# Altium project OK6410.PRJPCB (part 2 of 2)

## Sheet LED_USB_KEY.SchDoc
size 558 x 431 mm
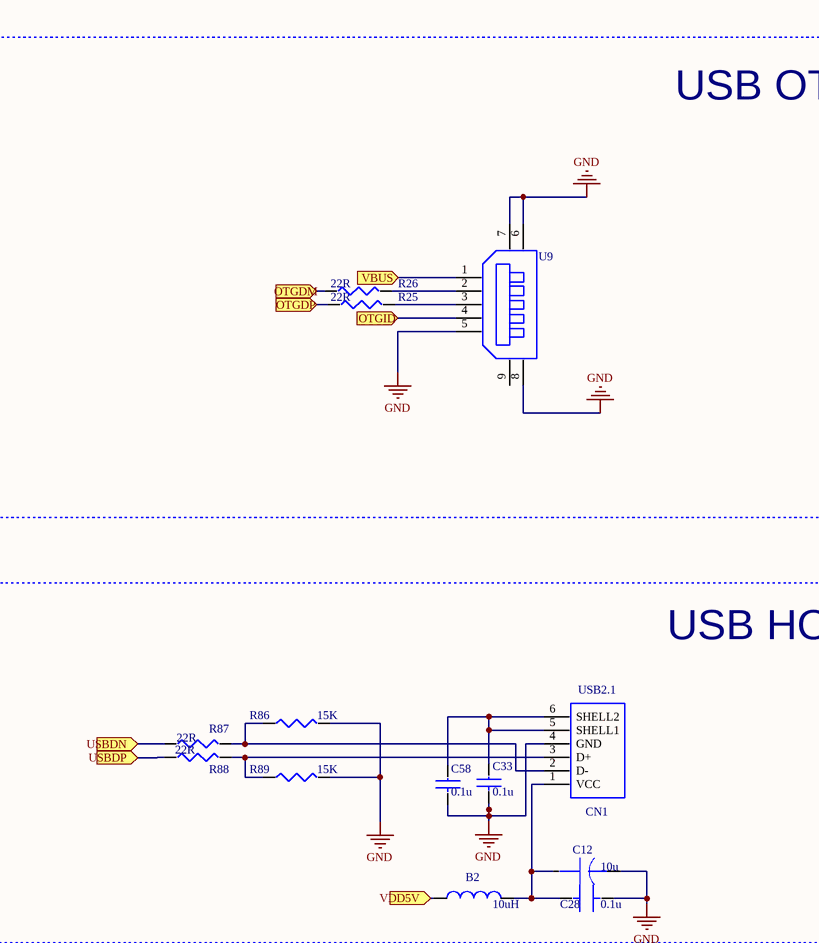
[diagram p20: LED_USB_KEY.SchDoc, top left]
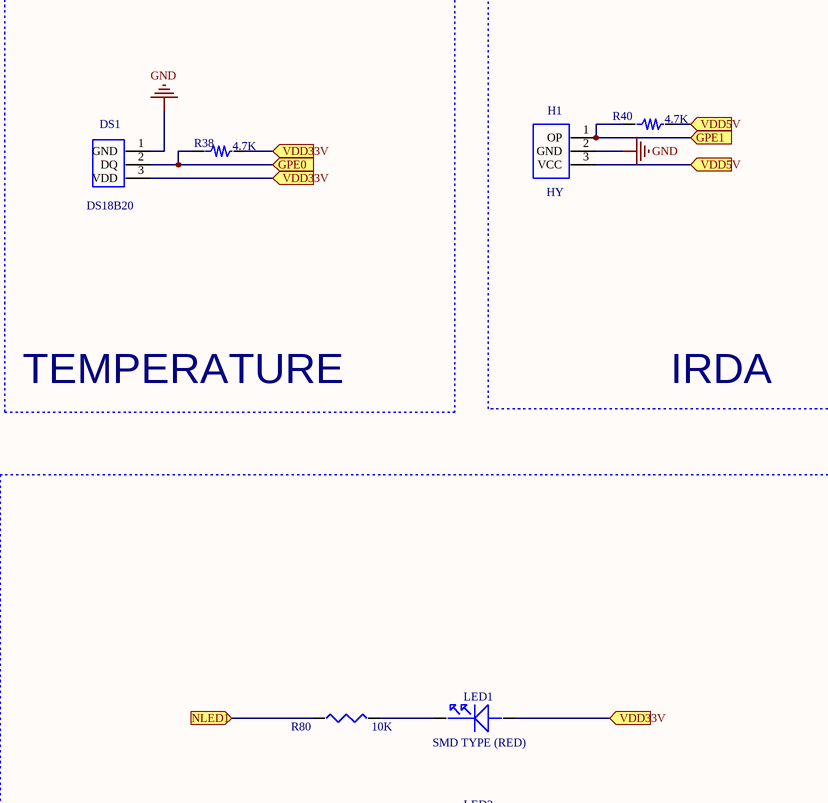
[diagram p21: LED_USB_KEY.SchDoc, top right]
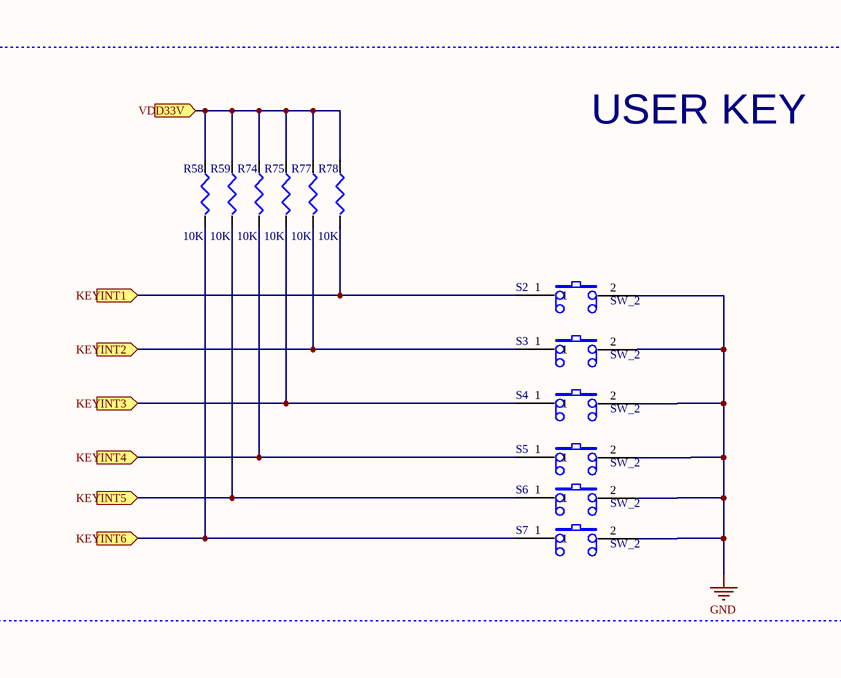
[diagram p22: LED_USB_KEY.SchDoc, bottom left]
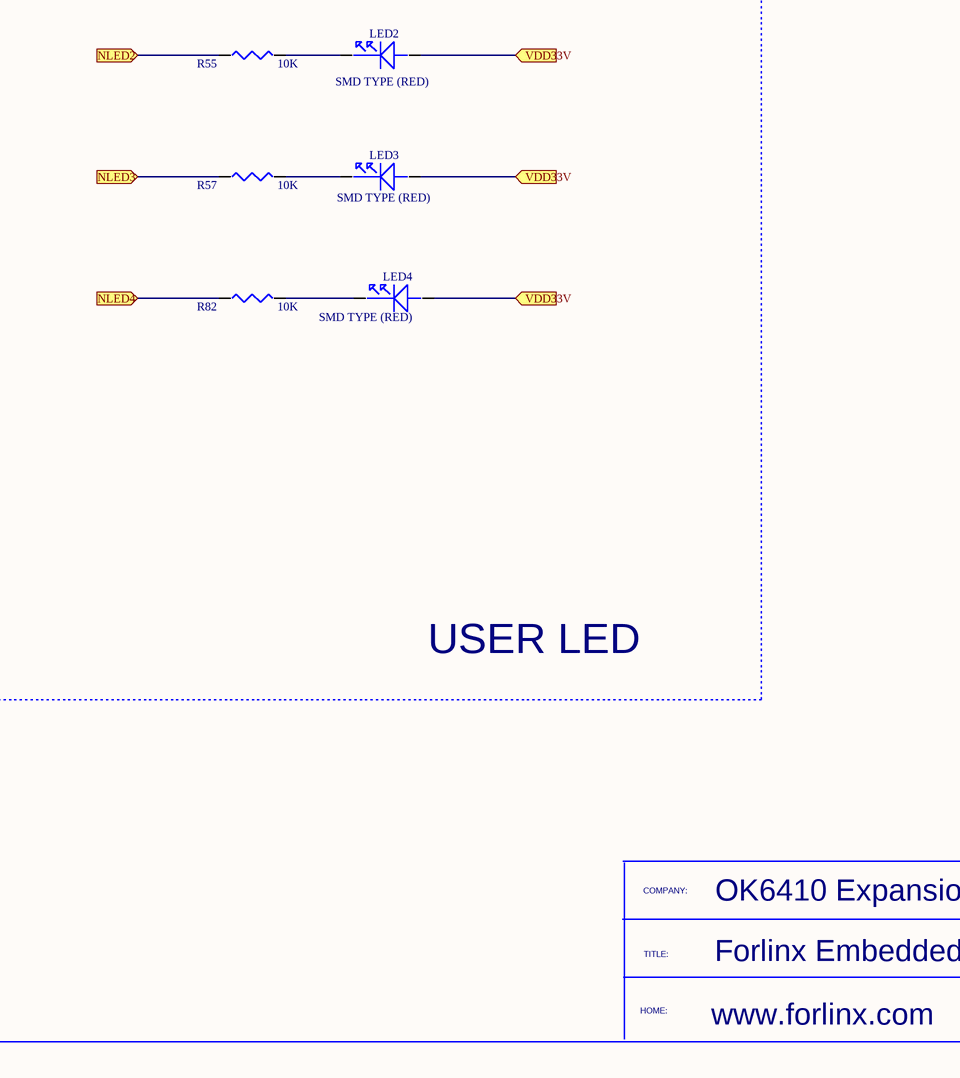
[diagram p23: LED_USB_KEY.SchDoc, bottom right]

### Parts
B2  value 10uH  (hidden comment: INDUCTOR_0)
C12  value 10u  (hidden comment: CAP-AE4)
C28  value 0.1u  (hidden comment: CAP_0)
C33  value 0.1u  (hidden comment: CAP_NP_0)
C58  value 0.1u  (hidden comment: CAP_NP_0)
CN1  USB2.1
DS1  DS18B20
H1  HY
LED1  value SMD TYPE (RED)  (hidden comment: LED_0)
LED2  value SMD TYPE (RED)  (hidden comment: LED_0)
LED3  value SMD TYPE (RED)  (hidden comment: LED_0)
LED4  value SMD TYPE (RED)  (hidden comment: LED_0)
R25  value 22R  (hidden comment: RESISTOR_2)
R26  value 22R  (hidden comment: RESISTOR_2)
R38  value 4.7K  (hidden comment: RES-Z)
R40  value 4.7K  (hidden comment: RES-Z)
R55  value 10K  (hidden comment: RESISTOR_2)
R57  value 10K  (hidden comment: RESISTOR_2)
R58  value 10K  (hidden comment: RESISTOR_2)
R59  value 10K  (hidden comment: RESISTOR_2)
R74  value 10K  (hidden comment: RESISTOR_2)
R75  value 10K  (hidden comment: RESISTOR_2)
R77  value 10K  (hidden comment: RESISTOR_2)
R78  value 10K  (hidden comment: RESISTOR_2)
R80  value 10K  (hidden comment: RESISTOR_2)
R82  value 10K  (hidden comment: RESISTOR_2)
R86  value 15K  (hidden comment: RESISTOR_2)
R87  value 22R  (hidden comment: RESISTOR_2)
R88  value 22R  (hidden comment: RESISTOR_2)
R89  value 15K  (hidden comment: RESISTOR_2)
S2  SW_2
S3  SW_2
S4  SW_2
S5  SW_2
S6  SW_2
S7  SW_2
U9  56579-0576  (value not drawn)

### Blocks framed on the sheet
USB OTG: R25 R26 U9
TEMPERATURE: DS1 R38
IRDA: H1 R40
USER LED: LED1-LED4 R55 R57 R80 R82
USB HOST: B2 C12 C28 C33 C58 CN1 R86-R89
USER KEY: R58 R59 R74 R75 R77 R78 S2-S7

### Ports
GPE0, GPE1, KEYINT1, KEYINT2, KEYINT3, KEYINT4, KEYINT5, KEYINT6, NLED1, NLED2, NLED3, NLED4, OTGDM, OTGDP, OTGID, USBDN, USBDP, VBUS, VDD5V, VDD33V

### Nets
GND: C12.2 C28.2 C33.2 C58.2 CN1.4(GND) DS1.1(GND) H1.2(GND) R86.2 R89.2 S2.2 S3.2 S4.2 S5.2 S6.2 S7.2 U9.1 U9.5 U9.6 U9.7 U9.8 ; port VBUS
NetB1_1: DS1.3(VDD) LED1.1 LED2.1 LED3.1 LED4.1 R38.2 R58.1 R59.1 R74.1 R75.1 R77.1 R78.1 ; port VDD33V
NetB2_1: B2.1 H1.3(VCC) R40.2 ; port VDD5V
NetB2_2: B2.2 C12.1 C28.1 CN1.1(VCC)
NetC33_1: C33.1 C58.1 CN1.2(D-) CN1.5(SHELL1) CN1.6(SHELL2) R86.1 R87.2
NetCN1_3: CN1.3(D+) R88.2 R89.1
NetDS1_2: DS1.2(DQ) R38.1 ; port GPE0
NetH1_1: H1.1(OP) R40.1 ; port GPE1
NetJ2_16: R88.1 ; port USBDP
NetJ2_18: R87.1 ; port USBDN
NetJ2_39: R82.1 ; port NLED4
NetJ2_46: R57.1 ; port NLED3
NetJ2_47: R80.1 ; port NLED1
NetJ2_49: R55.1 ; port NLED2
NetJ2_61: R58.2 S7.1 ; port KEYINT6
NetJ2_63: R74.2 S5.1 ; port KEYINT4
NetJ3_19: R75.2 S4.1 ; port KEYINT3
NetJ3_20: R59.2 S6.1 ; port KEYINT5
NetJ3_22: R78.2 S2.1 ; port KEYINT1
NetJ3_36: U9.4 ; port OTGID
NetJ3_38: R25.1 ; port OTGDP
NetJ3_40: R26.1 ; port OTGDM
NetJ3_49: R77.2 S3.1 ; port KEYINT2
NetLED1_2: LED1.2 R80.2
NetLED2_2: LED2.2 R55.2
NetLED3_2: LED3.2 R57.2
NetLED4_2: LED4.2 R82.2
NetR25_2: R25.2 U9.3
NetR26_2: R26.2 U9.2

Not connected (* = marked no-connect by the designer): U9 9

### Notes on the sheet
- COMPANY:
- TITLE:
- OK6410 Expansion Board
- HOME:
- www.forlinx.com
- Forlinx Embedded

### Library data of the parts
B2 = INDUCTOR_0: PCB DECAL: 1206
C12 = CAP-AE4: ALUMINUM ELECTROLYTIC CAP.; Manufacturer #1: IPC SM-782 STD.; PCB DECAL: 3216A
C28 = CAP_0: PCB Footprint: C0805; Source Path: C:\ORCADWIN\CAPTURE\DESIGN\MCU\S3C2400X\EV-BOARD\SMDK2400-72F.DSN; PCB DECAL: 0603A
C33 C58 = CAP_NP_0: PCB Footprint: C2012; PCB DECAL: 0603A
CN1 = USB2.1: PCB DECAL: USB-B2
DS1 = DS18B20: PCB DECAL: DSAAAA
H1 = HY: PCB DECAL: HY01
LED1-LED3 = LED_0: PCB Footprint: CAP3528; PCB DECAL: LEDX
LED4 = LED_0: PCB Footprint: CAP3528; PCB DECAL: LED1206N
R25 R26 R86-R89 = RESISTOR_2: PCB Footprint: C2012; PCB DECAL: 0603A
R38 R40 = RES-Z: RES BODY:060 CENTERS:400; PCB DECAL: 0603A
R55 R57-R59 R74 R75 R77 R78 R80 R82 = RESISTOR_2: PCB Footprint: C2012; Source Path: C:\WINDOW\GENERAL\2400\SCHEM\2400\SMDK2400-72F.DSN; PCB DECAL: 0603A
S2-S7 = SW_2: PCB Footprint: TM118D-A; Value: SW_PUSH2; PCB DECAL: SW-PB2
U9 = 56579-0576: PCB DECAL: USB\S

## Sheet NET.SchDoc
size 558 x 431 mm
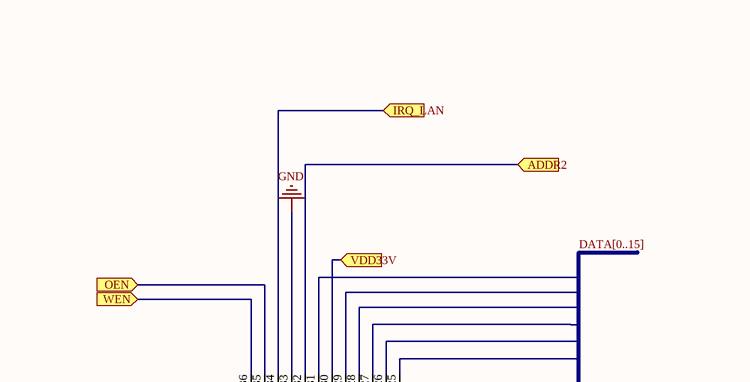
[diagram p24: NET.SchDoc, top left]
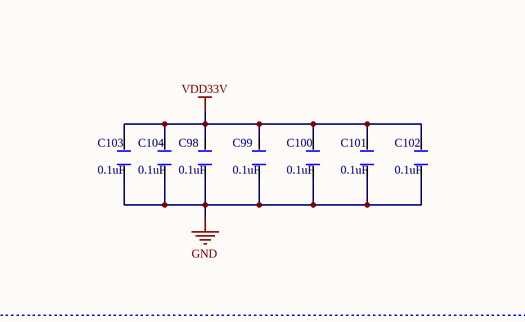
[diagram p25: NET.SchDoc, top right]
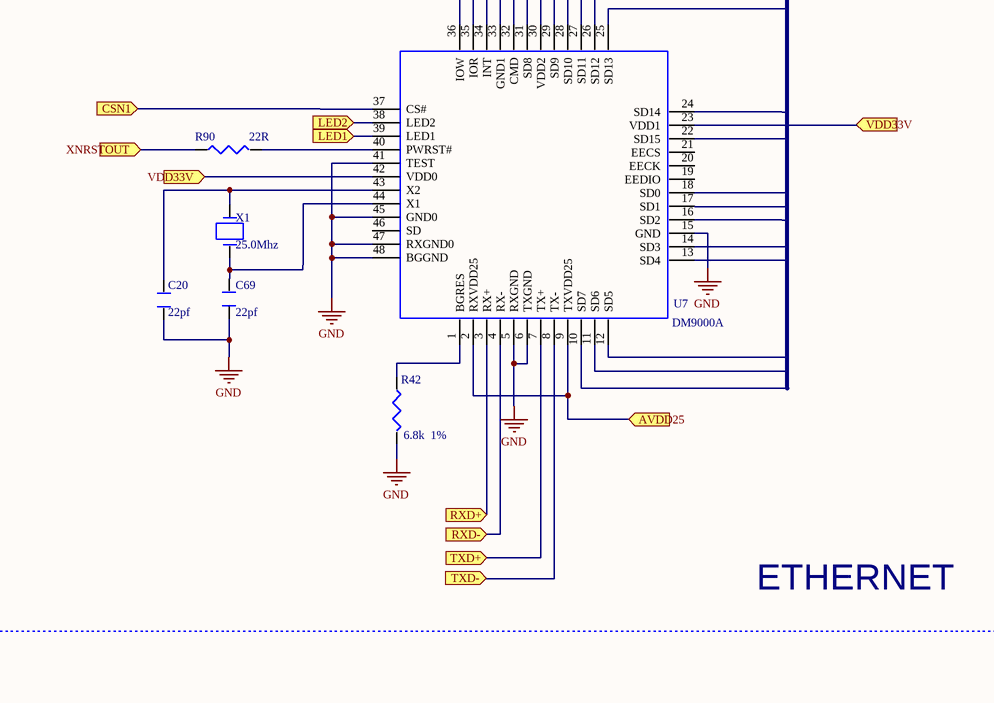
[diagram p26: NET.SchDoc, bottom left]
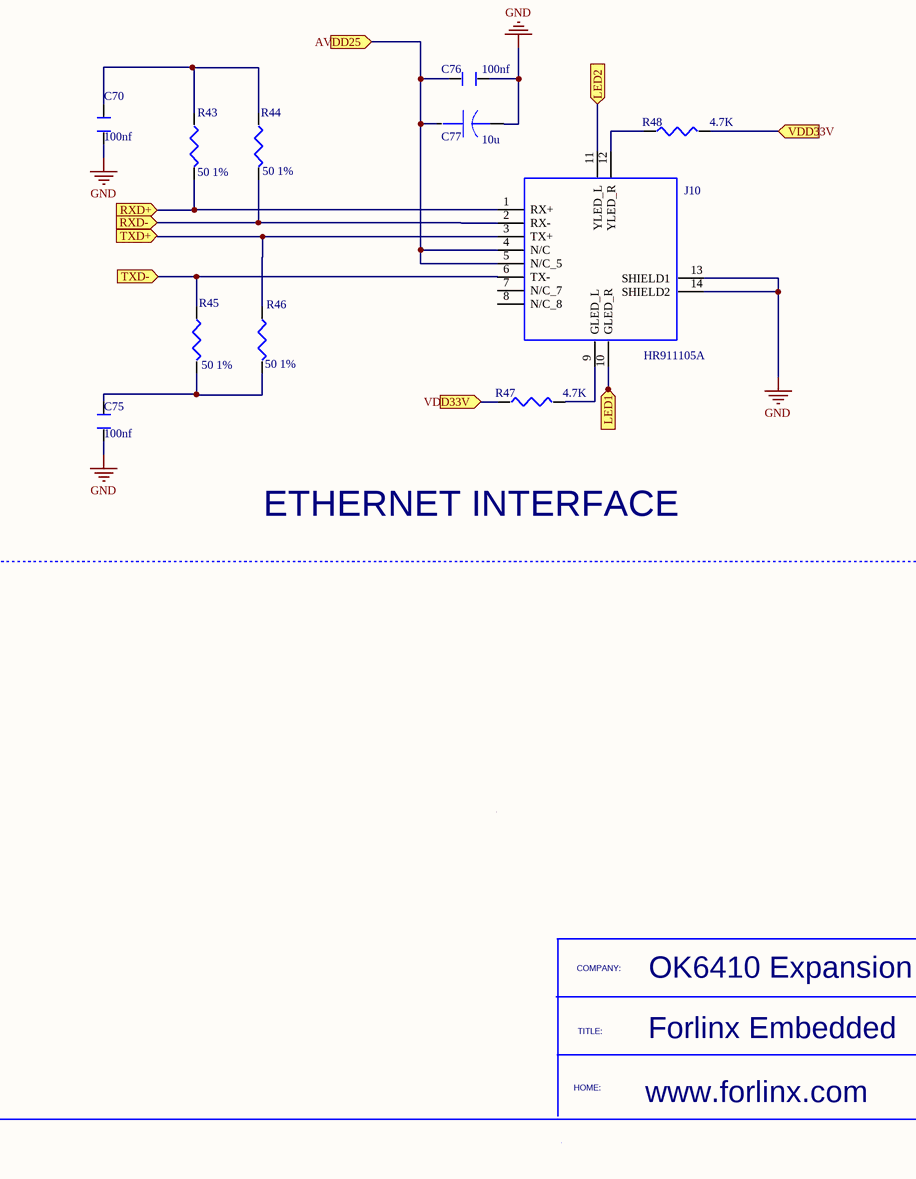
[diagram p27: NET.SchDoc, bottom right]

### Parts
C20  value 22pf  (hidden comment: C_0)
C69  value 22pf  (hidden comment: C_0)
C70  value 100nf  (hidden comment: C_0)
C75  value 100nf  (hidden comment: C_0)
C76  value 100nf  (hidden comment: C_0)
C77  value 10u  (hidden comment: CAP-AE4)
C98  value 0.1uF  (hidden comment: C_0)
C99  value 0.1uF  (hidden comment: C_0)
C100  value 0.1uF  (hidden comment: C_0)
C101  value 0.1uF  (hidden comment: C_0)
C102  value 0.1uF  (hidden comment: C_0)
C103  value 0.1uF  (hidden comment: C_0)
C104  value 0.1uF  (hidden comment: C_0)
J10  HR911105A
R42  value 6.8k  1%  (hidden comment: R_0)
R43  value 50 1%  (hidden comment: R_0)
R44  value 50 1%  (hidden comment: R_0)
R45  value 50 1%  (hidden comment: R_0)
R46  value 50 1%  (hidden comment: R_0)
R47  value 4.7K  (hidden comment: R_0)
R48  value 4.7K  (hidden comment: R_0)
R90  value 22R  (hidden comment: R_0)
U7  DM9000A
X1  value 25.0Mhz  (hidden comment: CRYSTALA)

### Blocks framed on the sheet
ETHERNET: C20 C69 R42 R90 U7 X1
ETHERNET INTERFACE: C70 C75-C77 J10 R43-R48

### Ports
ADDR2, AVDD25, CSN1, IRQ_LAN, LED1, LED2, OEN, RXD+, RXD-, TXD+, TXD-, VDD33V, WEN, XNRSTOUT

### Nets
GND: C20.1 C69.1 C70.1 C75.1 C76.1 C77.2 C98.1 C99.1 C100.1 C101.1 C102.1 C103.1 C104.1 J10.13(SHIELD1) J10.14(SHIELD2) R42.2 U7.5(RXGND) U7.6(TXGND) U7.15(GND) U7.33(GND1) U7.41(TEST) U7.45(GND0) U7.47(RXGND0) U7.48(BGGND)
VDD33V: C98.2 C99.2 C100.2 C101.2 C102.2 C103.2 C104.2
NetB1_1: R47.1 R48.2 U7.23(VDD1) U7.30(VDD2) U7.42(VDD0) ; port VDD33V
NetC20_2: C20.2 U7.43(X2) X1.2
NetC69_2: C69.2 U7.44(X1) X1.1
NetC70_2: C70.2 R43.1 R44.1
NetC75_2: C75.2 R45.2 R46.2
NetC76_2: C76.2 C77.1 J10.4(N/C) J10.5(N/C_5) U7.2(RXVDD25) U7.9(TXVDD25) ; port AVDD25
NetJ1_9: U7.32(CMD) ; port ADDR2
NetJ1_12: U7.36(IOW) ; port WEN
NetJ2_57: U7.34(INT) ; port IRQ_LAN
NetJ2_71: R90.1 ; port XNRSTOUT
NetJ3_69: U7.37(CS#) ; port CSN1
NetJ4_33: U7.35(IOR) ; port OEN
NetJ10_1: J10.1(RX+) R43.2 U7.3(RX+) ; port RXD+
NetJ10_2: J10.2(RX-) R44.2 U7.4(RX-) ; port RXD-
NetJ10_3: J10.3(TX+) R46.1 U7.7(TX+) ; port TXD+
NetJ10_6: J10.6(TX-) R45.1 U7.8(TX-) ; port TXD-
NetJ10_9: J10.9(GLED_L) R47.2
NetJ10_10: J10.10(GLED_R) U7.39(LED1) ; port LED1
NetJ10_11: J10.11(YLED_L) U7.38(LED2) ; port LED2
NetJ10_12: J10.12(YLED_R) R48.1
NetR42_1: R42.1 U7.1(BGRES)
NetR90_2: R90.2 U7.40(PWRST#)

Not connected (* = marked no-connect by the designer): J10 7(N/C_7) 8(N/C_8); U7 10(SD7) 11(SD6) 12(SD5) 13(SD4) 14(SD3) 16(SD2) 17(SD1) 18(SD0) 19(EEDIO) 20(EECK) 21(EECS) 22(SD15) 24(SD14) 25(SD13) 26(SD12) 27(SD11) 28(SD10) 29(SD9) 31(SD8) 46(SD)

### Buses and harness runs
bus DATA[0..15]

### Notes on the sheet
- COMPANY:
- TITLE:
- OK6410 Expansion Board
- HOME:
- Forlinx Embedded
- www.forlinx.com

### Library data of the parts
C20 C69 C70 C75 C76 C98-C104 = C_0: PCB Footprint: CM75; PCB DECAL: 0603A
C77 = CAP-AE4: as C12 on sheet LED_USB_KEY
J10 = HR911105A: PCB DECAL: RJ-45A12
R42-R48 R90 = R_0: PCB Footprint: C2012; PCB DECAL: 0603A
U7 = DM9000A: PCB DECAL: DM9000AE
X1 = CRYSTALA: PCB Footprint: X-C; PCB DECAL: OSC2PR-1

## Sheet POWER.SchDoc
size 558 x 431 mm
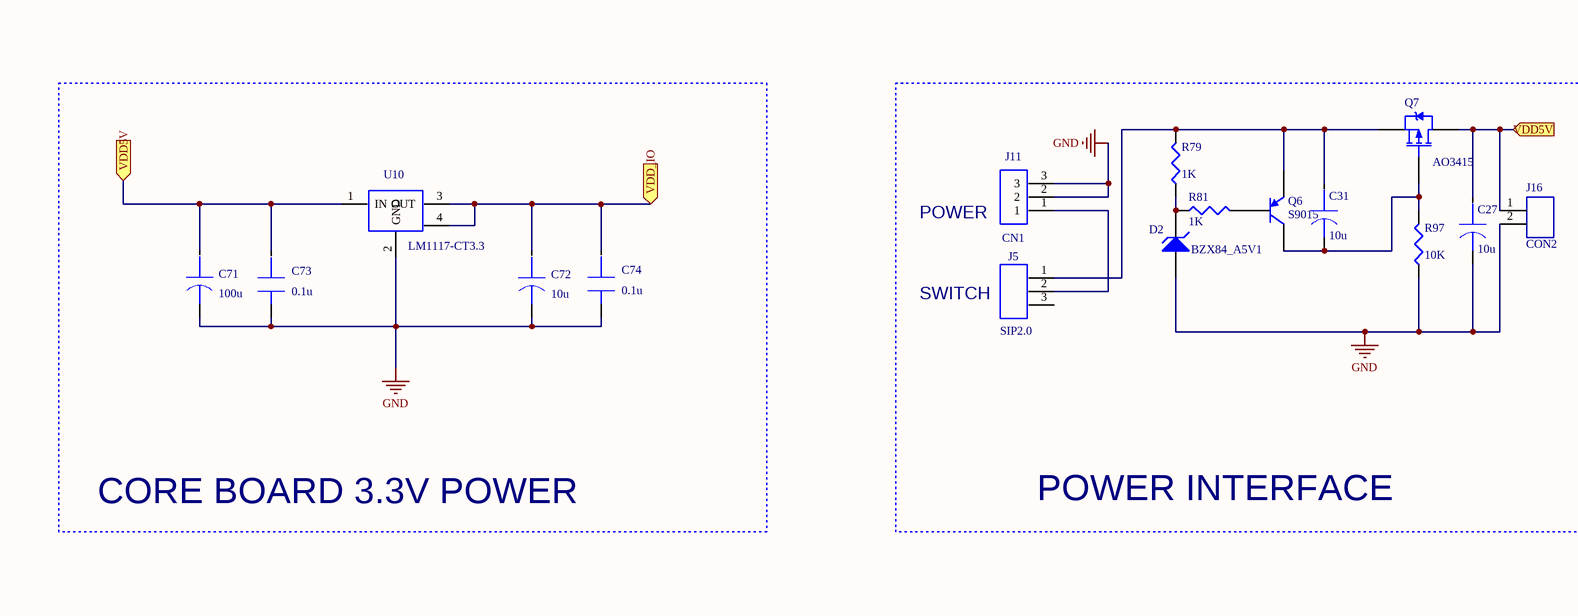
[diagram p28: POWER.SchDoc, top left]
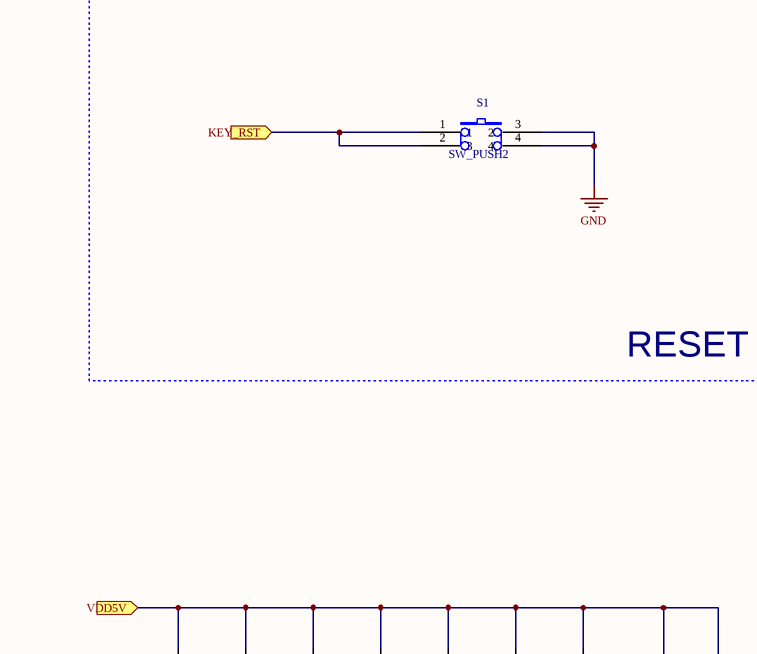
[diagram p29: POWER.SchDoc, top right]
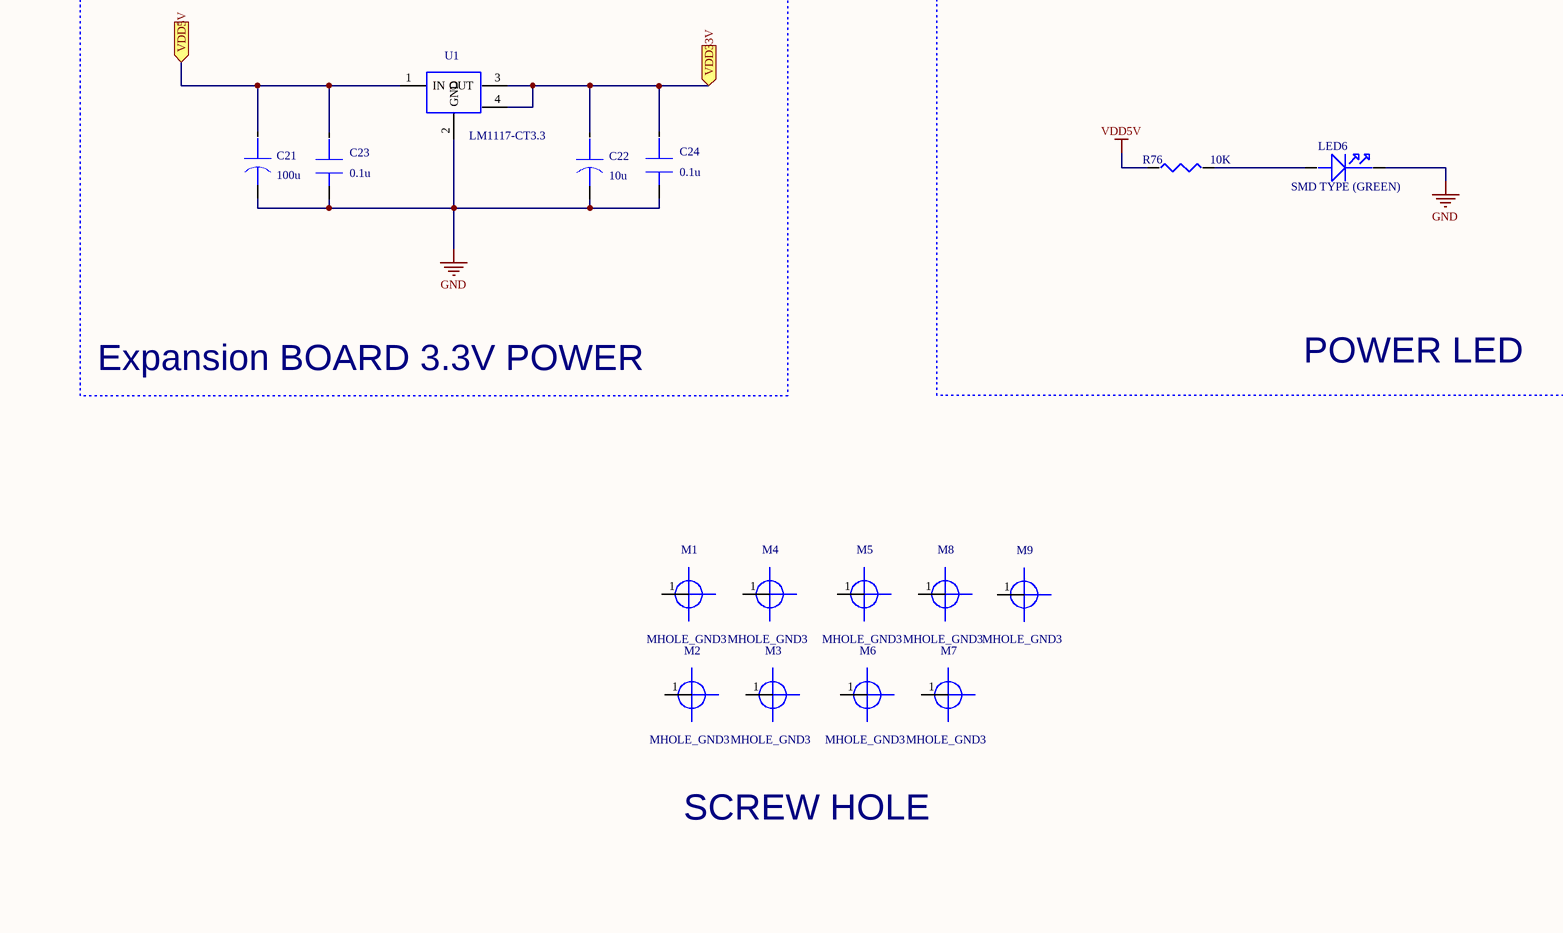
[diagram p30: POWER.SchDoc, bottom left]
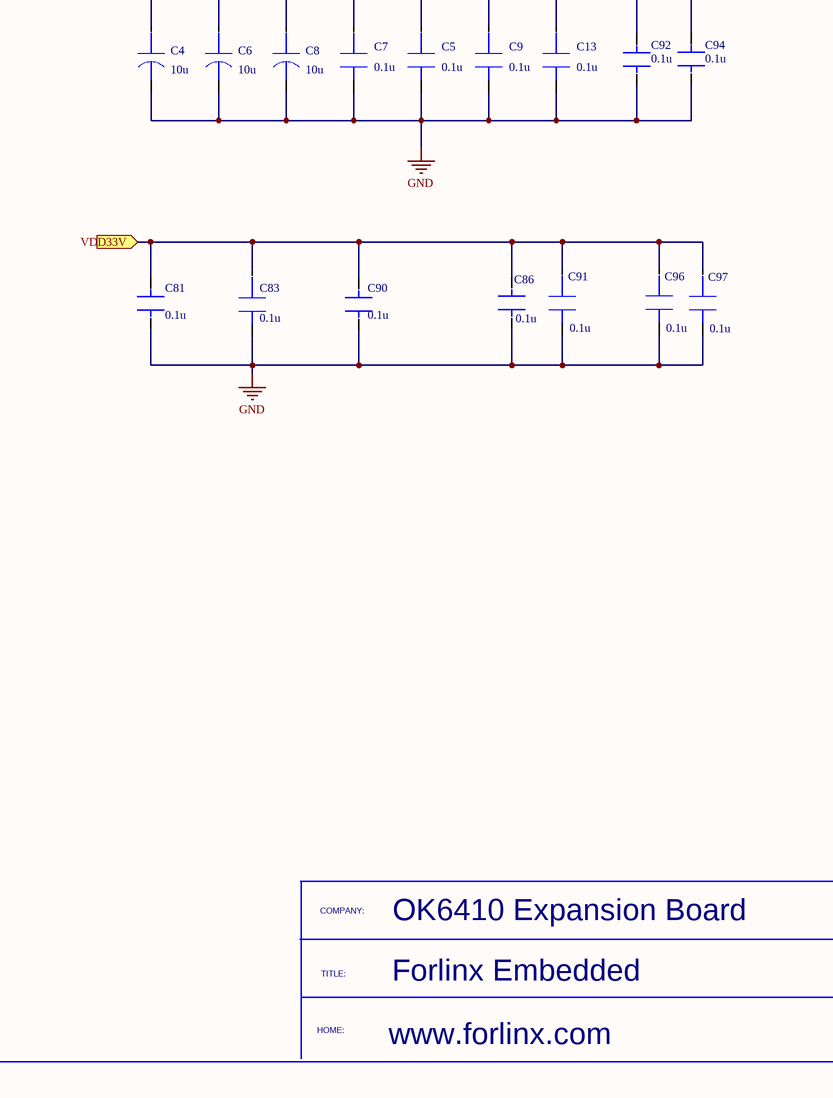
[diagram p31: POWER.SchDoc, bottom right]

### Parts
C4  value 10u  (hidden comment: CAP-AE4)
C5  value 0.1u  (hidden comment: CAP1206)
C6  value 10u  (hidden comment: CAP-AE4)
C7  value 0.1u  (hidden comment: CAP1206)
C8  value 10u  (hidden comment: CAP-AE4)
C9  value 0.1u  (hidden comment: CAP1206)
C13  value 0.1u  (hidden comment: CAP1206)
C21  value 100u  (hidden comment: CAP-AE4)
C22  value 10u  (hidden comment: CAP-AE4)
C23  value 0.1u  (hidden comment: CAP1206)
C24  value 0.1u  (hidden comment: CAP1206)
C27  value 10u  (hidden comment: CAP-AE4)
C31  value 10u  (hidden comment: CAP-AE4)
C71  value 100u  (hidden comment: CAP-AE4)
C72  value 10u  (hidden comment: CAP-AE4)
C73  value 0.1u  (hidden comment: CAP1206)
C74  value 0.1u  (hidden comment: CAP1206)
C81  value 0.1u  (hidden comment: CAP_0)
C83  value 0.1u  (hidden comment: CAP1206)
C86  value 0.1u  (hidden comment: CAP_0)
C90  value 0.1u  (hidden comment: CAP_0)
C91  value 0.1u  (hidden comment: CAP1206)
C92  value 0.1u  (hidden comment: CAP_0)
C94  value 0.1u  (hidden comment: CAP_0)
C96  value 0.1u  (hidden comment: CAP1206)
C97  value 0.1u  (hidden comment: CAP1206)
D2  BZX84_A5V1  [DIODE-0.7]
J5  SIP2.0
J11  CN1
J16  CON2  [SIP2S_2mm]
LED6  value SMD TYPE (GREEN)  (hidden comment: LED_0)
M1  MHOLE_GND3
M2  MHOLE_GND3
M3  MHOLE_GND3
M4  MHOLE_GND3
M5  MHOLE_GND3
M6  MHOLE_GND3
M7  MHOLE_GND3
M8  MHOLE_GND3
M9  MHOLE_GND3
Q6  S9015  [TO-92A]
Q7  AO3415  [TO-220AB]
R76  value 10K  (hidden comment: RESISTOR_2)
R79  value 1K  [J1-0603]  (hidden comment: Res3)
R81  value 1K  [J1-0603]  (hidden comment: Res3)
R97  value 10K  [J1-0603]  (hidden comment: Res3)
S1  SW_PUSH2
U1  LM1117-CT3.3
U10  LM1117-CT3.3

### Blocks framed on the sheet
CORE BOARD 3.3V POWER: C71-C74 U10
POWER INTERFACE: C27 C31 D2 J5 J11 J16 Q6 Q7 R79 R81 R97
RESET: S1
Expansion BOARD 3.3V POWER: C21-C24 U1
POWER LED: LED6 R76

### Ports
KEY_RST, VDD5V, VDD33V, VDD_IO

### Nets
GND: C4.2 C5.2 C6.2 C7.2 C8.2 C9.2 C13.2 C21.2 C22.2 C23.2 C24.2 C27.2 C71.2 C72.2 C73.2 C74.2 C81.2 C83.2 C86.2 C90.2 C91.2 C92.2 C94.2 C96.2 C97.2 D2.1(A) J11.2 J11.3 J16.2(DQ20) LED6.2 R97.1 S1.3(2) S1.4 U1.2(GND) U10.2(GND)
VDD5V: R76.1
NetB1_1: C22.1 C24.1 C81.1 C83.1 C86.1 C90.1 C91.1 C96.1 C97.1 U1.3(OUT) U1.4 ; port VDD33V
NetB2_1: C4.1 C5.1 C6.1 C7.1 C8.1 C9.1 C13.1 C21.1 C23.1 C27.1 C71.1 C73.1 C92.1 C94.1 J16.1(DQ19) Q7.2(D) U1.1(IN) U10.1(IN) ; port VDD5V
NetC31_1: C31.1 J5.1 Q6.1(E) Q7.3(S) R79.2
NetC31_2: C31.2 Q6.3(C) Q7.1(G) R97.2
NetC72_1: C72.1 C74.1 U10.3(OUT) U10.4 ; port VDD_IO
NetD2_2: D2.2(K) R79.1 R81.1
NetJ3_67: S1.1 S1.2(3) ; port KEY_RST
NetJ5_2: J5.2 J11.1
NetLED6_1: LED6.1 R76.2
NetQ6_2: Q6.2(B) R81.2

Not connected (* = marked no-connect by the designer): J5 3; M1 1; M2 1; M3 1; M4 1; M5 1; M6 1; M7 1; M8 1; M9 1

### Notes on the sheet
- POWER
- SWITCH
- SCREW HOLE
- COMPANY:
- OK6410 Expansion Board
- TITLE:
- Forlinx Embedded
- HOME:
- www.forlinx.com

### Library data of the parts
C4 C6 C8 C21 C22 C27 C31 C71 C72 = CAP-AE4: as C12 on sheet LED_USB_KEY
C5 C7 C9 C13 C23 C24 C73 C74 C83 C91 C96 C97 = CAP1206: SURFACE MOUNT CAPACITOR 0.062 X 0.126 INCHES; Manufacturer #1: IPC SM-782 STD.; PCB DECAL: 0603A
C81 C86 C90 C92 C94 = CAP_0: as C28 on sheet LED_USB_KEY
D2 = D Zener: Zener Diode; Published: 8-Jun-2000; LatestRevisionDate: 17-Jul-2002; LatestRevisionNote: Re-released for DXP Platform.; PackageReference: DIODE-0.7; Publisher: Altium Limited; PackageDescription: Diode, Thru-Hole; 2 Leads; 0.7 in Pin Spacing
J5 = SIP2.0: PCB DECAL: SWITCH_A
J11 = CN1: PCB DECAL: JACK-2.5MM_B
LED6 = LED_0: as LED4 on sheet LED_USB_KEY
M1-M9 = MHOLE_GND3: PCB DECAL: HOLE157-8STAR
Q6 = 2N3906: PNP General Purpose Amplifier; Published: 8-Jun-2000; LatestRevisionDate: 15-Jan-2003; LatestRevisionNote: PCB Footprint 'BCY-W3/D4.7' replaced; DatasheetVersion: 1997; PackageVersion: Sep-1998; PackageReference: TO-92A; Publisher: Altium Limited; PackageDescription: TO, Flat Index; 3 In-Line, Axial Leads; Body Dia. 4.5mm; Leads 0.51 x 0.48 mm (max); ComponentLink1Description: Manufacturer Link; ComponentLink1URL: http://www.fairchildsemi.com/; ComponentLink2Description: Datasheet; ComponentLink2URL: http://www.fairchildsemi.com/ds/2N%2F2N3906.pdf
Q7 = PMOS-2: P-Channel Power MOSFET; Note: Pin 4 not drawn and electrically connected to Pin 2.; Published: 8-Jun-2000; LatestRevisionDate: 17-Jul-2002; LatestRevisionNote: Re-released for DXP Platform.; DatasheetVersion: PD-9.390D; PackageVersion: Feb-1997; PackageReference: TO-220AB; Publisher: Altium Limited; PackageDescription: TO, Thru-Hole, Vertical, Heatsink Mounted; 3 In-Line Leads; Pitch 2.54 mm; ComponentLink1Description: Manufacturer Link; ComponentLink1URL: http://www.irf.com/
R76 = RESISTOR_2: PCB Footprint: C2012; PCB DECAL: 0603A
R79 R81 R97 = Res3: Resistor; Published: 8-Jun-2000; LatestRevisionDate: 29-May-2009; LatestRevisionNote: IPC-7351 Footprint Added.; PackageReference: J1-0603; Publisher: Altium Limited; PackageDescription: Chip Resistor
S1 = SW_PUSH2: PCB Footprint: TM118D-A; PCB DECAL: PUSHSW1
U1 U10 = LM1117-CT3.3: PCB DECAL: TO-252L

## Sheet REVISION_HISTORY.SchDoc
size 558 x 431 mm
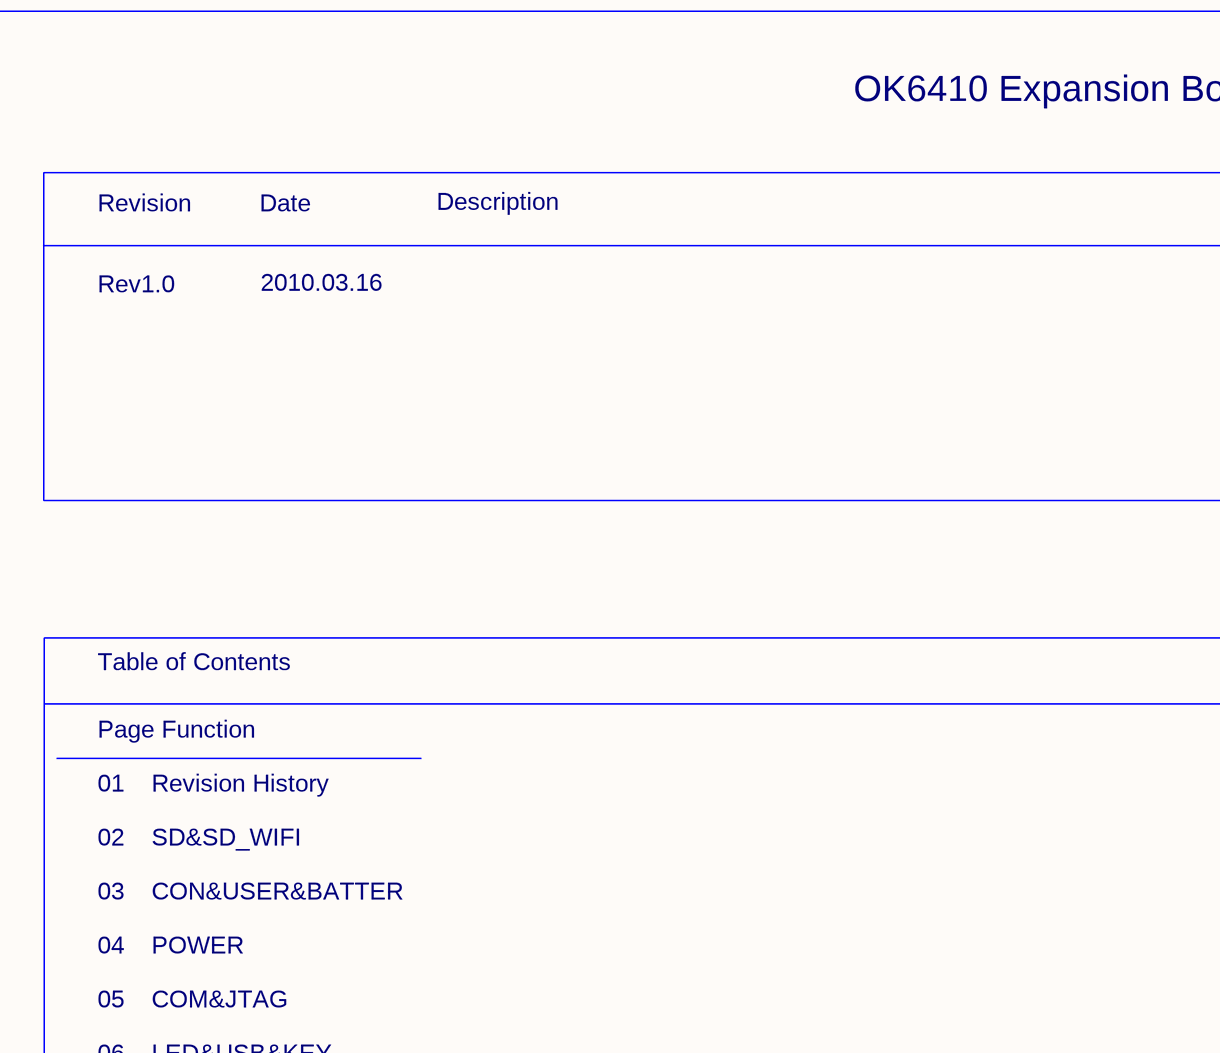
[diagram p32: REVISION_HISTORY.SchDoc, top left]
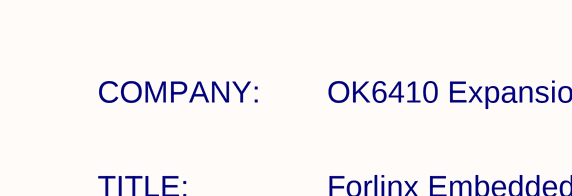
[diagram p33: REVISION_HISTORY.SchDoc, top right]
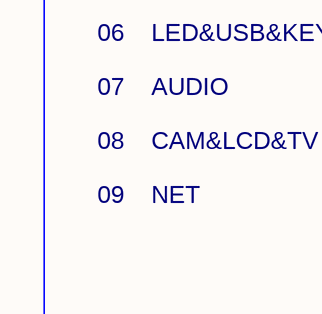
[diagram p34: REVISION_HISTORY.SchDoc, bottom left]
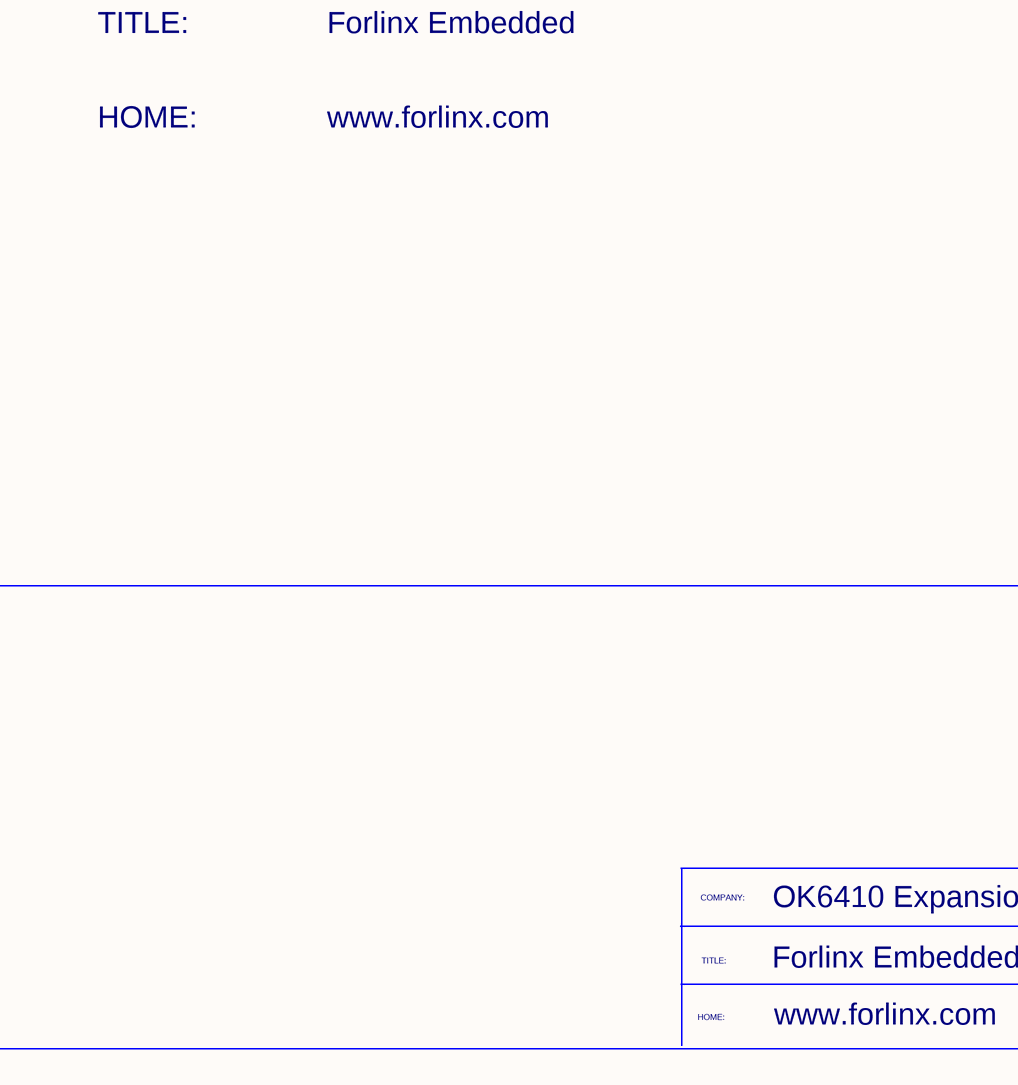
[diagram p35: REVISION_HISTORY.SchDoc, bottom right]

### Notes on the sheet
- OK6410 Expansion Board Schematic Diagram
- Revision
- Date
- Description
- Rev1.0
- 2010.03.16
- Table of Contents
- Page Function
- 01
- Revision History
- 02
- 03
- SD&SD_WIFI
- CON&USER&BATTER
- 04
- POWER
- COMPANY:
- OK6410 Expansion Board
- 05
- COM&JTAG
- 06
- LED&USB&KEY
- TITLE:
- Forlinx Embedded
- 07
- 08
- AUDIO
- CAM&LCD&TV
- HOME:
- www.forlinx.com
- 09
- NET

## Nets that join several sheets
GND: SD_SD_WIFI (11 pins), AUDIO (13 pins), CAM_LCD_TV (17 pins), COM_JTAG (25 pins), CON_USER_BATTER (64 pins), LED_USB_KEY (20 pins), NET (24 pins), POWER (35 pins)
VDD5V: COM_JTAG (C64.1 U5.16), POWER (R76.1)
VDD33V: SD_SD_WIFI (8 pins), COM_JTAG (6 pins), NET (7 pins)
EINT13: COM_JTAG (R41.2 SW2.8), CON_USER_BATTER (J3.15)
EINT14: COM_JTAG (R52.2 SW2.7), CON_USER_BATTER (J3.33)
EINT15: COM_JTAG (R21.2 SW2.6), CON_USER_BATTER (J3.16)
NetB1_1: SD_SD_WIFI (14 pins), AUDIO (6 pins), CAM_LCD_TV (8 pins), COM_JTAG (10 pins), CON_USER_BATTER (D1.2), LED_USB_KEY (12 pins), NET (5 pins), POWER (11 pins)
NetB2_1: SD_SD_WIFI (R2.2), AUDIO (C10.1 R27.1 U8.1), CAM_LCD_TV (C50.1 C52.1 R14.2 U3.1), CON_USER_BATTER (6 pins), LED_USB_KEY (B2.1 H1.3 R40.2), POWER (18 pins)
NetC1_1: CAM_LCD_TV (C1.1 CON1.40), CON_USER_BATTER (J4.1 J12.16)
NetC2_1: CAM_LCD_TV (C2.1 CON1.38), CON_USER_BATTER (J4.4 J12.14)
NetC3_1: CAM_LCD_TV (C3.1 R66.1), CON_USER_BATTER (J2.43)
NetC29_1: CAM_LCD_TV (C29.1 CON1.39), CON_USER_BATTER (J4.3 J12.15)
NetC30_1: CAM_LCD_TV (C30.1 CON1.37), CON_USER_BATTER (J4.2 J12.13)
NetC72_1: CON_USER_BATTER (12 pins), POWER (C72.1 C74.1 U10.3 U10.4)
NetC85_1: AUDIO (R39.1), CAM_LCD_TV (6 pins), COM_JTAG (R53.1), CON_USER_BATTER (J8.20 J12.1)
NetCN2_3: COM_JTAG (CN2.3 R3.2 RA2.1), CON_USER_BATTER (J3.46)
NetCN2_5: COM_JTAG (CN2.5 RA2.2), CON_USER_BATTER (J3.35)
NetCN2_7: COM_JTAG (CN2.7 RA2.3), CON_USER_BATTER (J3.29)
NetCN2_9: COM_JTAG (CN2.9 R5.2), CON_USER_BATTER (J3.47)
NetCN2_13: COM_JTAG (CN2.13), CON_USER_BATTER (J3.37)
NetCN2_15: COM_JTAG (CN2.15 R3.1), CON_USER_BATTER (J3.65)
NetCN4_1: SD_SD_WIFI (CN4.1 R29.1), CON_USER_BATTER (J2.22)
NetCN4_3: SD_SD_WIFI (CN4.3 R23.1), CON_USER_BATTER (J1.52)
NetCN4_5: SD_SD_WIFI (CN4.5 R24.1), CON_USER_BATTER (J4.50)
NetCN4_6: SD_SD_WIFI (CN4.6 R33.1), CON_USER_BATTER (J3.60)
NetCN4_7: SD_SD_WIFI (CN4.7 R31.1), CON_USER_BATTER (J4.46)
NetCN4_8: SD_SD_WIFI (CN4.8 R32.1), CON_USER_BATTER (J4.21)
NetCN4_9: SD_SD_WIFI (CN4.9 R30.1), CON_USER_BATTER (J3.56)
NetCN4_11: SD_SD_WIFI (CN4.11 R18.1), CON_USER_BATTER (J1.57)
NetCN4_13: SD_SD_WIFI (CN4.13 R20.1), CON_USER_BATTER (J4.52)
NetCN4_15: SD_SD_WIFI (CN4.15 R22.1), CON_USER_BATTER (J1.58)
NetCON1_3: CAM_LCD_TV (CON1.3), CON_USER_BATTER (J3.13)
NetCON1_4: CAM_LCD_TV (CON1.4), CON_USER_BATTER (J3.27)
NetCON1_5: CAM_LCD_TV (CON1.5), CON_USER_BATTER (J3.14)
NetCON1_6: CAM_LCD_TV (CON1.6), CON_USER_BATTER (J3.43)
NetCON1_7: CAM_LCD_TV (CON1.7), CON_USER_BATTER (J3.11)
NetCON1_8: CAM_LCD_TV (CON1.8), CON_USER_BATTER (J2.64)
NetCON1_9: CAM_LCD_TV (CON1.9), CON_USER_BATTER (J2.65)
NetCON1_10: CAM_LCD_TV (CON1.10), CON_USER_BATTER (J3.12)
NetCON1_12: CAM_LCD_TV (CON1.12), CON_USER_BATTER (J3.31)
NetCON1_13: CAM_LCD_TV (CON1.13), CON_USER_BATTER (J2.66)
NetCON1_14: CAM_LCD_TV (CON1.14), CON_USER_BATTER (J2.62)
NetCON1_15: CAM_LCD_TV (CON1.15), CON_USER_BATTER (J2.68)
NetCON1_16: CAM_LCD_TV (CON1.16), CON_USER_BATTER (J3.24)
NetCON1_17: CAM_LCD_TV (CON1.17), CON_USER_BATTER (J3.9)
NetCON1_18: CAM_LCD_TV (CON1.18), CON_USER_BATTER (J2.55)
NetCON1_19: CAM_LCD_TV (CON1.19), CON_USER_BATTER (J3.7)
NetCON1_21: CAM_LCD_TV (CON1.21), CON_USER_BATTER (J2.70)
NetCON1_22: CAM_LCD_TV (CON1.22), CON_USER_BATTER (J3.10)
NetCON1_23: CAM_LCD_TV (CON1.23), CON_USER_BATTER (J2.56)
NetCON1_24: CAM_LCD_TV (CON1.24), CON_USER_BATTER (J3.8)
NetCON1_25: CAM_LCD_TV (CON1.25), CON_USER_BATTER (J3.6)
NetCON1_26: CAM_LCD_TV (CON1.26), CON_USER_BATTER (J3.5)
NetCON1_27: CAM_LCD_TV (CON1.27), CON_USER_BATTER (J2.51)
NetCON1_28: CAM_LCD_TV (CON1.28), CON_USER_BATTER (J2.60)
NetCON1_31: CAM_LCD_TV (CON1.31 JP1.1), CON_USER_BATTER (J8.17 R96.1)
NetCON1_32: CAM_LCD_TV (CON1.32 JP1.2), CON_USER_BATTER (J8.18 R67.2)
NetCON2_1: SD_SD_WIFI (CON2.1 R94.1), CON_USER_BATTER (J1.29)
NetCON2_2: SD_SD_WIFI (CON2.2 R93.1), CON_USER_BATTER (J1.28)
NetCON2_7: SD_SD_WIFI (CON2.7 R92.1), CON_USER_BATTER (J1.61)
NetCON2_8: SD_SD_WIFI (CON2.8 R91.1), CON_USER_BATTER (J1.26)
NetCON2_9: SD_SD_WIFI (CON2.9 R95.1), CON_USER_BATTER (J1.48)
NetCON2_10: SD_SD_WIFI (CON2.10 R19.1), CON_USER_BATTER (J2.1)
NetCON2_11: SD_SD_WIFI (CON2.11 R51.1), CON_USER_BATTER (J1.59)
NetDS1_2: CON_USER_BATTER (J4.49), LED_USB_KEY (DS1.2 R38.1)
NetDZQ_2: SD_SD_WIFI (DZQ.2), CON_USER_BATTER (J4.20 J12.19)
NetH1_1: CON_USER_BATTER (J1.21), LED_USB_KEY (H1.1 R40.1)
NetJ1_9: CON_USER_BATTER (J1.9), NET (U7.32)
NetJ1_12: CON_USER_BATTER (J1.12), NET (U7.36)
NetJ1_15: AUDIO (U2.11), CON_USER_BATTER (J1.15)
NetJ1_17: AUDIO (U2.8), CON_USER_BATTER (J1.17)
NetJ1_19: AUDIO (U2.5), CON_USER_BATTER (J1.19)
NetJ1_31: COM_JTAG (U5.12), CON_USER_BATTER (J1.31)
NetJ1_34: AUDIO (U2.6), CON_USER_BATTER (J1.34 J4.30)
NetJ1_36: AUDIO (U2.10), CON_USER_BATTER (J1.36)
NetJ1_37: COM_JTAG (U5.9), CON_USER_BATTER (J1.37)
NetJ1_39: CAM_LCD_TV (JP1.10), CON_USER_BATTER (J1.39)
NetJ1_40: CAM_LCD_TV (R16.2), CON_USER_BATTER (J1.40)
NetJ1_41: CAM_LCD_TV (JP1.13), CON_USER_BATTER (J1.41)
NetJ1_43: CAM_LCD_TV (JP1.12), CON_USER_BATTER (J1.43)
NetJ1_45: CAM_LCD_TV (JP1.4), CON_USER_BATTER (J1.45)
NetJ1_47: SD_SD_WIFI (R1.2), CON_USER_BATTER (J1.47)
NetJ1_49: CAM_LCD_TV (JP1.8), CON_USER_BATTER (J1.49)
NetJ1_51: CAM_LCD_TV (R85.2), CON_USER_BATTER (J1.51)
NetJ1_55: CAM_LCD_TV (JP1.15), CON_USER_BATTER (J1.55)
NetJ1_68: COM_JTAG (U5.10), CON_USER_BATTER (J1.68)
NetJ1_70: COM_JTAG (U5.11), CON_USER_BATTER (J1.70)
NetJ1_71: CAM_LCD_TV (JP1.9), CON_USER_BATTER (J1.71)
NetJ1_72: CAM_LCD_TV (JP1.11), CON_USER_BATTER (J1.72)
NetJ1_73: CAM_LCD_TV (JP1.14), CON_USER_BATTER (J1.73)
NetJ1_74: CAM_LCD_TV (JP1.16), CON_USER_BATTER (J1.74)
NetJ1_75: CAM_LCD_TV (JP1.7), CON_USER_BATTER (J1.75)
NetJ1_76: CAM_LCD_TV (JP1.6), CON_USER_BATTER (J1.76)
NetJ2_16: CON_USER_BATTER (J2.16), LED_USB_KEY (R88.1)
NetJ2_18: CON_USER_BATTER (J2.18), LED_USB_KEY (R87.1)
NetJ2_39: CON_USER_BATTER (J2.39), LED_USB_KEY (R82.1)
NetJ2_46: CON_USER_BATTER (J2.46), LED_USB_KEY (R57.1)
NetJ2_47: CON_USER_BATTER (J2.47), LED_USB_KEY (R80.1)
NetJ2_49: CON_USER_BATTER (J2.49), LED_USB_KEY (R55.1)
NetJ2_52: CAM_LCD_TV (R64.1), CON_USER_BATTER (J2.52)
NetJ2_57: CON_USER_BATTER (J2.57), NET (U7.34)
NetJ2_61: CON_USER_BATTER (J2.61), LED_USB_KEY (R58.2 S7.1)
NetJ2_63: CON_USER_BATTER (J2.63), LED_USB_KEY (R74.2 S5.1)
NetJ2_71: CON_USER_BATTER (J2.71), NET (R90.1)
NetJ3_3: CAM_LCD_TV (R4.1), CON_USER_BATTER (J3.3)
NetJ3_4: CAM_LCD_TV (R65.1), CON_USER_BATTER (J3.4)
NetJ3_19: CON_USER_BATTER (J3.19), LED_USB_KEY (R75.2 S4.1)
NetJ3_20: CON_USER_BATTER (J3.20), LED_USB_KEY (R59.2 S6.1)
NetJ3_22: CON_USER_BATTER (J3.22), LED_USB_KEY (R78.2 S2.1)
NetJ3_25: COM_JTAG (R13.1 RA2.4), CON_USER_BATTER (J3.25)
NetJ3_30: COM_JTAG (R12.2 R53.2), CON_USER_BATTER (J3.30)
NetJ3_34: COM_JTAG (J9.2), CON_USER_BATTER (J3.34)
NetJ3_36: CON_USER_BATTER (J3.36), LED_USB_KEY (U9.4)
NetJ3_38: CON_USER_BATTER (J3.38), LED_USB_KEY (R25.1)
NetJ3_40: CON_USER_BATTER (J3.40), LED_USB_KEY (R26.1)
NetJ3_49: CON_USER_BATTER (J3.49), LED_USB_KEY (R77.2 S3.1)
NetJ3_52: CAM_LCD_TV (R35.1), CON_USER_BATTER (J3.52)
NetJ3_55: CAM_LCD_TV (R83.2), CON_USER_BATTER (J3.55)
NetJ3_67: CON_USER_BATTER (J3.67), POWER (S1.1 S1.2)
NetJ3_69: CON_USER_BATTER (J3.69), NET (U7.37)
NetJ4_33: CON_USER_BATTER (J4.33), NET (U7.35)
OM1: COM_JTAG (R7.2 SW2.5), CON_USER_BATTER (J3.51)
OM2: COM_JTAG (R8.2 SW2.4), CON_USER_BATTER (J3.32)
OM3: COM_JTAG (R9.2 SW2.3), CON_USER_BATTER (J3.54)
OM4: COM_JTAG (R10.2 SW2.2), CON_USER_BATTER (J3.26)
SELNAND: COM_JTAG (R11.2 SW2.1), CON_USER_BATTER (J2.69)